# Altium schematic sheet Connectors.SchDoc: Connectors
size Letter; SheetNumber: 5; SheetTotal: 11
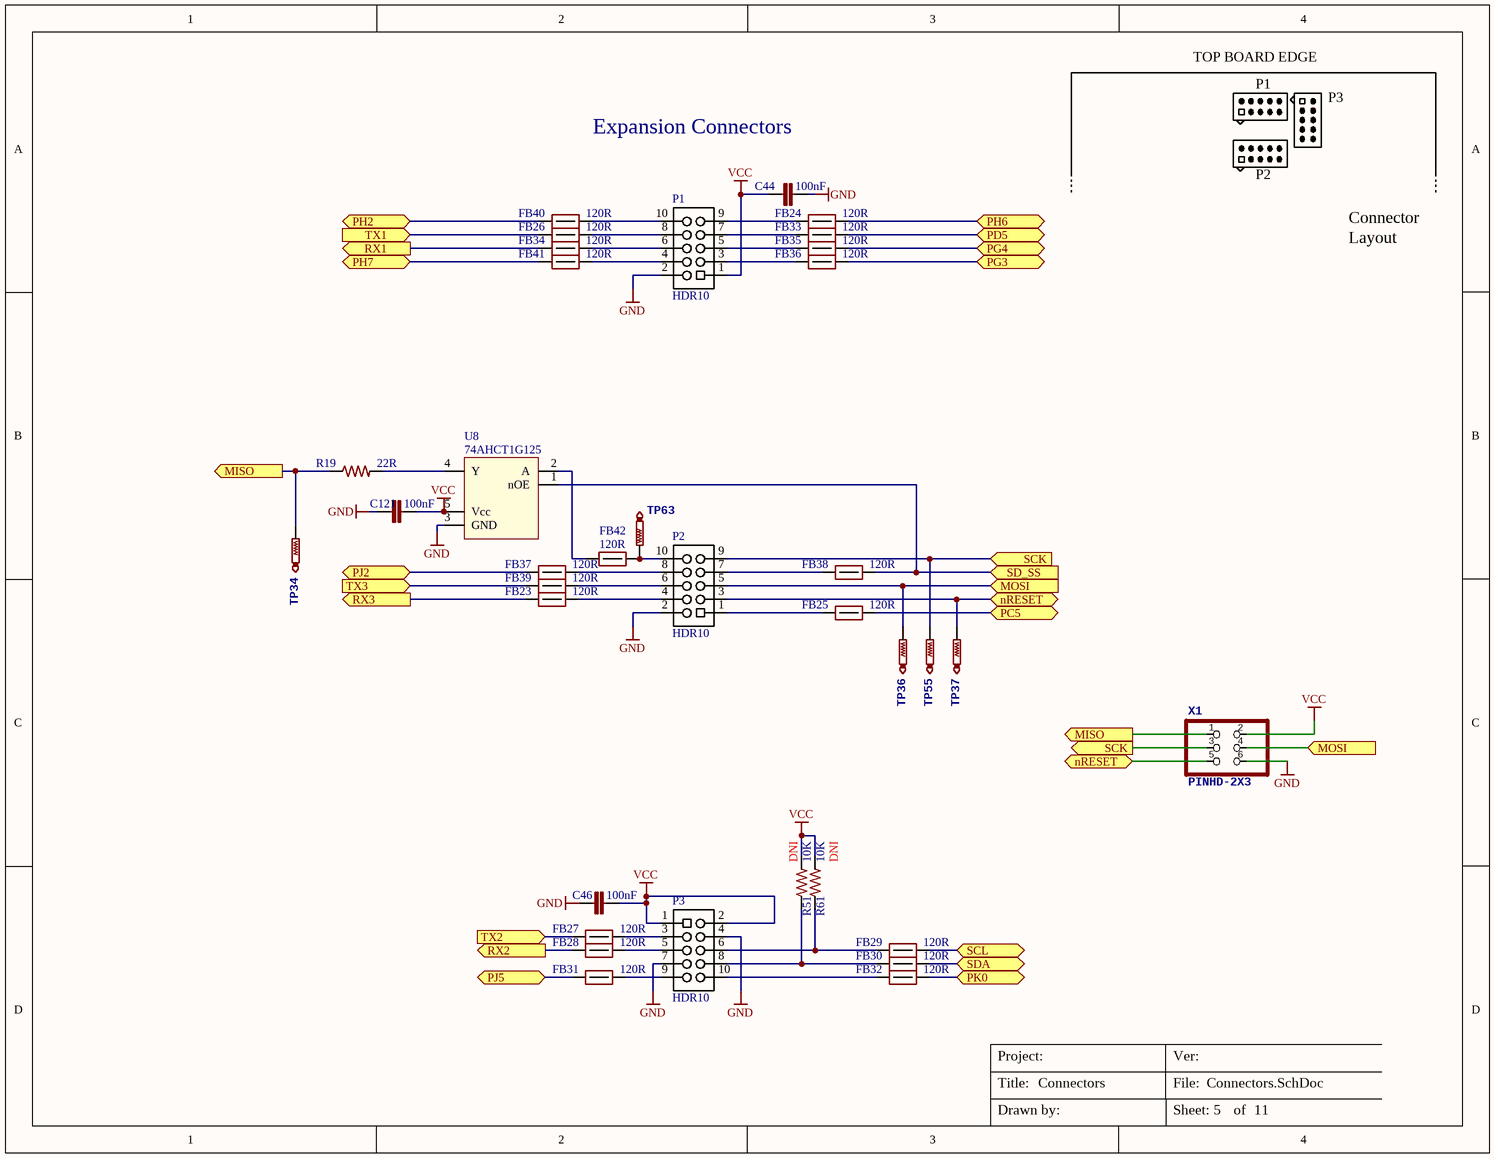
[diagram p0: Connectors.SchDoc]

## Parts
C44  100nF  [C0402]
C46  100nF  [C0402]
C121  100nF  [C0402]
FB23  120R  [R0402]
FB24  120R  [R0402]
FB25  120R  [R0402]
FB26  120R  [R0402]
FB27  120R  [R0402]
FB28  120R  [R0402]
FB29  120R  [R0402]
FB30  120R  [R0402]
FB31  120R  [R0402]
FB32  120R  [R0402]
FB33  120R  [R0402]
FB34  120R  [R0402]
FB35  120R  [R0402]
FB36  120R  [R0402]
FB37  120R  [R0402]
FB38  120R  [R0402]
FB39  120R  [R0402]
FB40  120R  [R0402]
FB41  120R  [R0402]
FB42  120R  [R0402]
P1  HDR10  [HDR2X5 IDC]
P2  HDR10  [HDR2X5 IDC]
P3  HDR10  [HDR2X5 IDC THIEVING]
R19  22R  [R0402]
R51  10K  [R0402]
R61  10K  [R0402]
TP34  TestPoint  [TP1-27]  (value not drawn)  (no BOM)
TP36  TestPoint  [TP1-27]  (value not drawn)  (no BOM)
TP37  TestPoint  [TP1-27]  (value not drawn)  (no BOM)
TP55  TestPoint  [TP1-27]  (value not drawn)  (no BOM)
TP63  TestPoint  [TP1-27]  (value not drawn)  (no BOM)
U8  74AHCT1G125  [SOTFL50P160X60-5L]
X1  PINHD-2X3  [2X03]

## Ports
MISO, MOSI, nRESET, PC5, PD5, PG3, PG4, PH2, PH6, PH7, PJ2, PJ5, PK0, RX1, RX2, RX3, SCK, SCL, SD_SS, SDA, TX1, TX2, TX3

## Nets
GND: C44.2 C46.1 C121.1 P1.2 P2.2 P3.4 P3.7 U8.3(GND) X1.6
VCC: C44.1 C46.2 C121.2 P1.1 P3.1 P3.2 R51.2 R61.2 U8.5(Vcc) X1.2
MISO: R19.1 TP34.TP X1.1 ; port MISO
MOSI: P2.5 TP36.TP X1.4 ; port MOSI
nRESET: P2.3 TP37.TP X1.5 ; port nRESET
PC5: FB25.2 ; port PC5
PD5: FB33.2 ; port PD5
PG3: FB36.2 ; port PG3
PG4: FB35.2 ; port PG4
PH2: FB40.1 ; port PH2
PH6: FB24.2 ; port PH6
PH7: FB41.1 ; port PH7
PJ2: FB37.1 ; port PJ2
PJ5: FB31.1 ; port PJ5
PK0: FB32.2 ; port PK0
RX1: FB34.1 ; port RX1
RX2: FB28.1 ; port RX2
RX3: FB23.1 ; port RX3
SCK: P2.9 TP55.TP X1.3 ; port SCK
SCL: FB29.2 ; port SCL
SD_SS: FB38.2 U8.1(nOE) ; port SD_SS
SDA: FB30.2 ; port SDA
TX1: FB26.1 ; port TX1
TX2: FB27.1 ; port TX2
TX3: FB39.1 ; port TX3
NetFB23_2: FB23.2 P2.4
NetFB24_1: FB24.1 P1.9
NetFB25_1: FB25.1 P2.1
NetFB26_2: FB26.2 P1.8
NetFB27_2: FB27.2 P3.3
NetFB28_2: FB28.2 P3.5
NetFB29_1: FB29.1 P3.6 R61.1
NetFB30_1: FB30.1 P3.8 R51.1
NetFB31_2: FB31.2 P3.9
NetFB32_1: FB32.1 P3.10
NetFB33_1: FB33.1 P1.7
NetFB34_2: FB34.2 P1.6
NetFB35_1: FB35.1 P1.5
NetFB36_1: FB36.1 P1.3
NetFB37_2: FB37.2 P2.8
NetFB38_1: FB38.1 P2.7
NetFB39_2: FB39.2 P2.6
NetFB40_2: FB40.2 P1.10
NetFB41_2: FB41.2 P1.4
NetFB42_1: FB42.1 U8.2(A)
NetFB42_2: FB42.2 P2.10 TP63.TP
NetR19_2: R19.2 U8.4(Y)

Not connected (* = marked no-connect by the designer): U8 23(NC)

## Notes on the sheet
- TOP BOARD EDGE
- P1
- P3
- Expansion Connectors
- P2
- Connector
- Layout
- Title:
- Project:
- File:
- Ver:
- Drawn by:
- Sheet:
- of

## Library data of the parts
C44 C46 C121 = GRM155R71C104KA88D: CAP CER 0402 100nF 16V 10% X7R; MANUFACTURER: Murata; PART DESCRIPTION: 0.10µF ±10% 16V Ceramic Capacitor X7R 0402 (1005 Metric); TOLERANCE: +/- 10%; EE_SPEC: 100nF 16V X7R 0402; VALUE: 100nF; MANUFACTURER #: GRM155R71C104KA88D; DISTRIBUTOR #: 490-3261-2-ND; DISTRIBUTOR: Digi-Key; PART: 100nF
FB23-FB42 = FERRITE 120R 1A 0402: FERRITE BEAD 120 OHM 0402 1LN; MANUFACTURER: Taiyo Yuden; MANUFACTURER #: BKP1005HS121-T; VALUE: 120Rfb; TOLERANCE: -NA-; EE_SPEC: 1A; DISTRIBUTOR #: 587-1921-2-ND; DISTRIBUTOR: Digikey; PART: FERRITE 120R 1A 0402; PART DESCRIPTION: FERRITE BEAD 120 OHM 0402 1LN
P1-P3 = Header 10PIN 2ROW T-HOLE VERT SHROUDED: CONN HEADER VERT 10POS GOLD; MANUFACTURER #: 302-S101; MANUFACTURER: On Shore; PART DESCRIPTION: 10 Positions Header Connector 0.100" (2.54mm) Through Hole Gold; TOLERANCE: -NA-; DISTRIBUTOR #: ED1543-ND; DISTRIBUTOR: Digikey; PART: HDR10; VALUE: HDR10; EE_SPEC: -NA-
R19 = RC0402FR-0722RL: RES 0402 22r 62.5mW 1%; Manufacturer: Yageo; Part Description: 22 Ohm ±1% 0.063W, 1/16W Chip Resistor 0402 (1005 Metric) Moisture Resistant Thick Film; EE_SPEC: 22R 1% 0402; Tolerance: +/- 1%; VALUE: 22R; DISTRIBUTOR #: 311-22.0LRTR-ND; DISTRIBUTOR: Digi-Key; MANUFACTURER #: RC0402FR-0722RL; PART: 22R
R51 R61 = RC0402FR-0710KP: RES SMD 10K OHM 1% 1/16W 0402; MANUFACTURER: Yageo; PART: 10k 1% 0402; PART DESCRIPTION: 10k Ohm ±1% 0.063W, 1/16W Chip Resistor 0402 (1005 Metric) Moisture Resistant Thick Film; EE_SPEC: 10k 1% 0402 1/16W; VALUE: 10K; MANUFACTURER #: RC0402FR-0710KP; DISTRIBUTOR #: YAG1249TR-ND; DISTRIBUTOR: Digi-Key; TOLERANCE: 1%; DNI: DNI
TP34 TP36 TP37 TP55 TP63 = TestPoint: Test Point
U8 = SN74AHCT1G125DRLR: IC BUS BUFF TRI-ST N-INV  SOT-553; MANUFACTURER: TI; PART DESCRIPTION: Buffer, Non-Inverting 1 Element 1 Bit per Element Push-Pull Output SOT-5; TOLERANCE: -NA-; EE_SPEC: 4.5-5.5V; MANUFACTURER #: SN74AHCT1G125DRLR; DISTRIBUTOR #: 296-19379-2-ND; DISTRIBUTOR: Digikey; PART: SN74AHCT1G125DRLR; VALUE: 74AHCT1G125
X1 = PINHD-2X3: CONN HEADER VERT 6POS GOLD; Manufacturer: MultiComp; MANUFACTURER #: 2213S-06G; PART: 6PIN; Part Description: 6 Positions Header Connector 0.100" (2.54mm) Through Hole Gold; EE_SPEC: 10Pin 2Row 0.1" T-Hole; Tolerance: NA; VALUE: 6PIN; DISTRIBUTOR #: 08N6789; DISTRIBUTOR: Newark